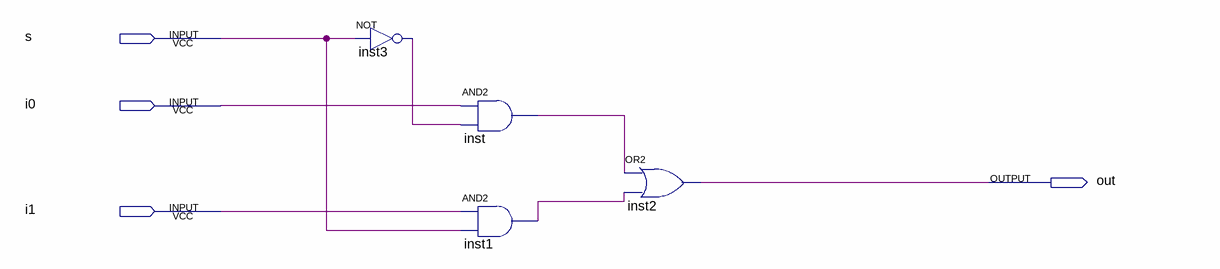
[diagram p0: schematic sheet]
// Quartus schematic Mux_2_1bit.bdf as structural Verilog: 4 symbols, 4 pins
module Mux_2_1bit (
  input  s,
  input  i0,
  input  i1,
  output out
);

  wire inst1_out, inst3_out, inst_out;

  not inst3 (inst3_out, s);
  and inst (inst_out, i0, inst3_out);
  and inst1 (inst1_out, i1, s);
  or inst2 (out, inst_out, inst1_out);
endmodule
